# Altium schematic sheet jieneng.SchDoc
size A4 portrait; SheetNumber: 1; SheetTotal: 1
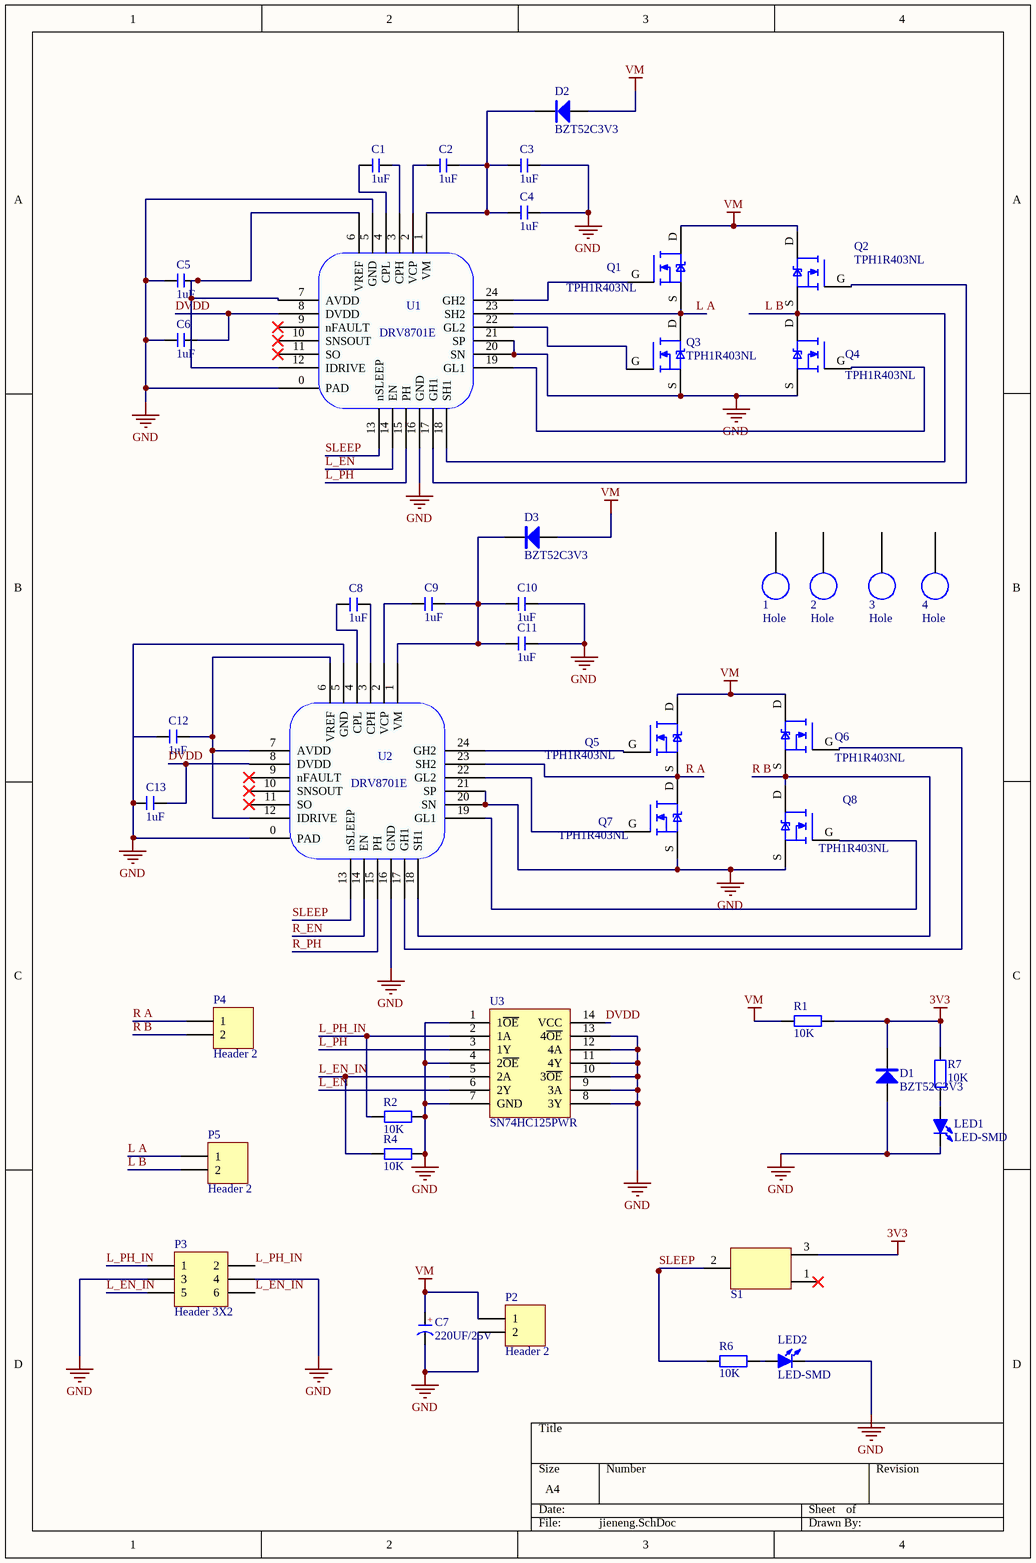
[diagram p0: jieneng.SchDoc]

## Parts
1  Hole  [Hole]
2  Hole  [Hole]
3  Hole  [Hole]
4  Hole  [Hole]
C1  1uF  [C 0603]
C2  1uF  [C 0603]
C3  1uF  [C 0603]
C4  1uF  [C 0603]
C5  1uF  [C 0603]
C6  1uF  [C 0603]
C7  220UF/25V  [CAP 3.5*8*11.5 - GD]
C8  1uF  [C 0603]
C9  1uF  [C 0603]
C10  1uF  [C 0603]
C11  1uF  [C 0603]
C12  1uF  [C 0603]
C13  1uF  [C 0603]
D1  BZT52C3V3  [SOD-123]
D2  BZT52C3V3  [SOD-123]
D3  BZT52C3V3  [SOD-123]
LED1  LED-SMD  [LED 0603R]
LED2  LED-SMD  [LED 0603R]
P2  Header 2  [接线端子-2]
P3  Header 3X2  [201S2X3]
P4  Header 2  [接线端子-2]
P5  Header 2  [接线端子-2]
Q1  TPH1R403NL  [TPH1R403NL]
Q2  TPH1R403NL  [TPH1R403NL]
Q3  TPH1R403NL  [TPH1R403NL]
Q4  TPH1R403NL  [TPH1R403NL]
Q5  TPH1R403NL  [TPH1R403NL]
Q6  TPH1R403NL  [TPH1R403NL]
Q7  TPH1R403NL  [TPH1R403NL]
Q8  TPH1R403NL  [TPH1R403NL]
R1  10K  [R 0603]
R2  10K  [R 0603]
R4  10K  [R 0603]
R6  10K  [R 0603]
R7  10K  [R 0603]
S1  ON   OFF  [驱动开关]  (value not drawn)
U1  DRV8701E  [QFN24]
U2  DRV8701E  [QFN24]
U3  SN74HC125PWR  [TSSOP14]

## Nets
3V3: D1.2(K) R1.2 R7.2 S1.3
GND: C3.2 C4.2 C5.1 C6.1 C7.2(K) C10.2 C11.2 C12.1 C13.1 D1.1(A) LED1.2(K) LED2.2(K) P2.2 P3.3 P3.4 Q3.S Q4.S Q7.S Q8.S R2.1 R4.1 U1.0(PAD) U1.5(GND) U1.16(GND) U1.20(SN) U1.21(SP) U2.0(PAD) U2.5(GND) U2.16(GND) U2.20(SN) U2.21(SP) U3.1(1~{OE}) U3.4(2~{OE}) U3.7(GND) U3.8(3Y) U3.9(3A) U3.10(3~{OE}) U3.11(4Y) U3.12(4A) U3.13(4~{OE})
VM: C7.1(A) D2.1(A) D3.1(A) P2.1 Q1.D Q2.D Q5.D Q6.D R1.1
DVDD: C6.2 C13.2 U1.8(DVDD) U2.8(DVDD) U3.14(VCC)
L A: P5.1 Q1.S Q3.D U1.23(SH2)
L B: P5.2 Q2.S Q4.D U1.18(SH1)
L_EN: U1.14(EN) U3.6(2Y)
L_EN_IN: P3.5 P3.6 R4.2 U3.5(2A)
L_PH: U1.15(PH) U3.3(1Y)
L_PH_IN: P3.1 P3.2 R2.2 U3.2(1A)
R A: P4.1 Q7.D U2.23(SH2)
R B: P4.2 Q6.S Q8.D U2.18(SH1)
R_EN: U2.14(EN)
R_PH: U2.15(PH)
SLEEP: R6.1 S1.2 U1.13(nSLEEP) U2.13(nSLEEP)
NetC1_1: C1.1 U1.4(CPL)
NetC1_2: C1.2 U1.3(CPH)
NetC2_1: C2.1 U1.2(VCP)
NetC2_2: C2.2 C3.1 C4.1 D2.2(K) U1.1(VM)
NetC5_2: C5.2 U1.6(VREF) U1.7(AVDD) U1.12(IDRIVE)
NetC8_1: C8.1 U2.4(CPL)
NetC8_2: C8.2 U2.3(CPH)
NetC9_1: C9.1 U2.2(VCP)
NetC9_2: C9.2 C10.1 C11.1 D3.2(K) U2.1(VM)
NetC12_2: C12.2 U2.6(VREF) U2.7(AVDD) U2.12(IDRIVE)
NetLED1_1: LED1.1(A) R7.1
NetLED2_1: LED2.1(A) R6.2
NetQ1_G: Q1.G U1.24(GH2)
NetQ2_G: Q2.G U1.17(GH1)
NetQ3_G: Q3.G U1.22(GL2)
NetQ4_G: Q4.G U1.19(GL1)
NetQ5_G: Q5.G U2.24(GH2)
NetQ6_G: Q6.G U2.17(GH1)
NetQ7_G: Q7.G U2.22(GL2)
NetQ8_G: Q8.G U2.19(GL1)

Not connected (* = marked no-connect by the designer): 1 1; 2 1; 3 1; 4 1; Q5 S; S1 1*; U1 9(nFAULT)* 10(SNSOUT)* 11(SO)*; U2 9(nFAULT)* 10(SNSOUT)* 11(SO)*

## Notes on the sheet
- (in symbol C-CAP) +

## Library data of the parts
C1-C6 C8-C13 = C: 无极性贴片电容; 版权归属: 源创客; BOM名称: 无极性贴片电容; 学习资源: www.ooocke.com
C7 = C-CAP: 直插电解电容; 版权归属: 源创客; BOM名称: 直插电解电容; 学习资源: www.ooocke.com
D1-D3 = 1N4007_1: 整流二极管; 版权归属: 源创客; BOM名称: 整流二极管; 学习资源: www.ooocke.com
LED1 LED2 = LED-SMD: 贴片LED; 版权归属: 源创客; BOM名称: 贴片LED; 学习资源: www.ooocke.com
P2 P4 P5 = Header 2: Header, 2-Pin; LatestRevisionDate: 17-Jul-2002; LatestRevisionNote: Re-released for DXP Platform.; Publisher: Altium Limited
P3 = Header 3X2: Header, 3-Pin, Dual row; LatestRevisionDate: 17-Jul-2002; LatestRevisionNote: Re-released for DXP Platform.; Publisher: Altium Limited
R1 R2 R4 R6 R7 = R: 贴片电阻; 版权归属: 源创客; BOM名称: 贴片电阻; 学习资源: www.ooocke.com
S1 = 开关
U3 = SN74HC125PWR: Published: 8-Jun-2000; LatestRevisionDate: 13-Apr-2006; LatestRevisionNote: IPC-7351 Footprint Added.; DatasheetVersion: May-1997; PackageVersion: Mar-2000; PackageReference: DW020; Publisher: Altium Limited; PackageDescription: 20-Pin Plastic Small Outline Integrated Circuit 1.27 mm Pitch; Code_JEDEC: MS-013; Code_IPC: SOIC127P1030-20; ComponentLink1Description: Manufacturer Link; ComponentLink1URL: http://www.ti.com/; ComponentLink2Description: Datasheet; ComponentLink2URL: http://www-s.ti.com/sc/ds/sn74hc244.pdf